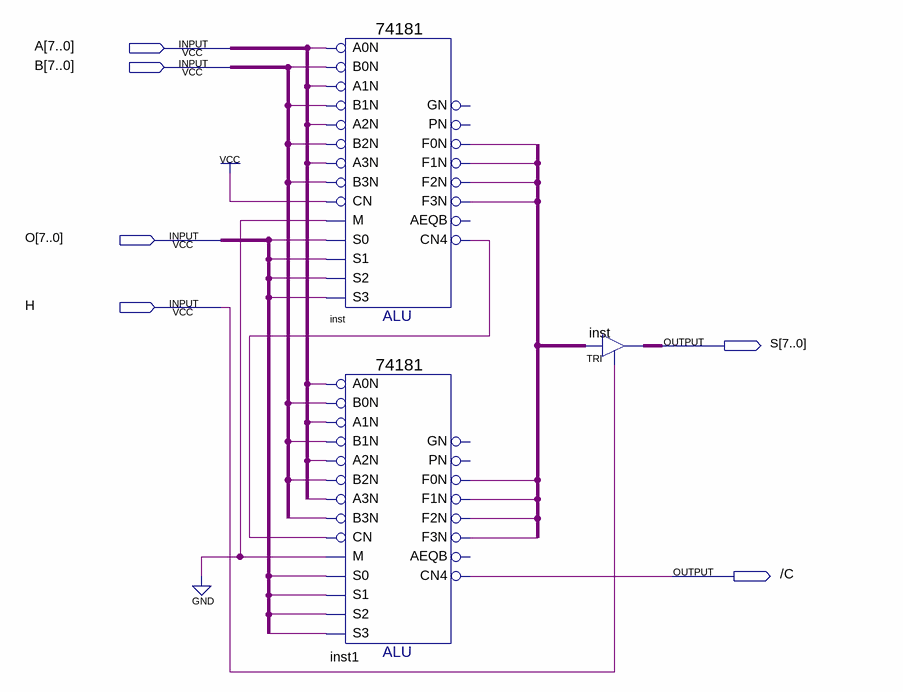
[diagram p0: schematic sheet]
// Quartus schematic ULA - UnidadeLogicaEAritmetica.bdf as structural Verilog: 3 symbols, 6 pins
module \ULA_-_UnidadeLogicaEAritmetica  (
  input  [7:0] A,
  input  [7:0] B,
  input  [7:0] O,
  input  H,
  output [7:0] S,
  output \/C 
);

  wire inst1_f0n, inst1_f1n, inst1_f2n, inst1_f3n, inst_cn4, inst_f0n, inst_f1n, inst_f2n, inst_f3n,
       undriven_2, undriven_3, undriven_4, undriven_5, undriven_6, undriven_7, undriven_8, undriven_9,
       undriven_10, undriven_11, undriven_12, undriven_13, undriven_14, undriven_15, undriven_16,
       undriven_17, undriven_18, undriven_19, undriven_20, undriven_21, undriven_22, undriven_23,
       undriven_24, undriven_25;
  wire [7:0] undriven;

  \74181  inst (
    .B0N(undriven_10), .A0N(undriven_2), .A1N(undriven_7), .B1N(undriven_16), .A3N(undriven_9),
    .B2N(undriven_15), .A2N(undriven_8), .M(1'b0), .CN(1'b1), .B3N(undriven_17), .S2(undriven_24),
    .S1(undriven_23), .S0(undriven_18), .S3(undriven_25), .F3N(inst_f3n), .F1N(inst_f1n), .F0N(inst_f0n),
    .CN4(inst_cn4), .F2N(inst_f2n));  // open: PN, GN, AEQB
  \74181  inst1 (
    .B0N(undriven_14), .A0N(undriven_6), .A1N(undriven_5), .B1N(undriven_13), .A3N(undriven_3),
    .B2N(undriven_12), .A2N(undriven_4), .M(1'b0), .CN(inst_cn4), .B3N(undriven_11), .S2(undriven_20),
    .S1(undriven_21), .S0(undriven_22), .S3(undriven_19), .F3N(inst1_f3n), .F1N(inst1_f1n), .F0N(inst1_f0n),
    .CN4(\/C ), .F2N(inst1_f2n));  // open: PN, GN, AEQB
  TRI inst_dup2[7:0] (.IN(undriven), .OE(H), .OUT(S));
endmodule
